# Altium schematic sheet Analog.SchDoc
size A4
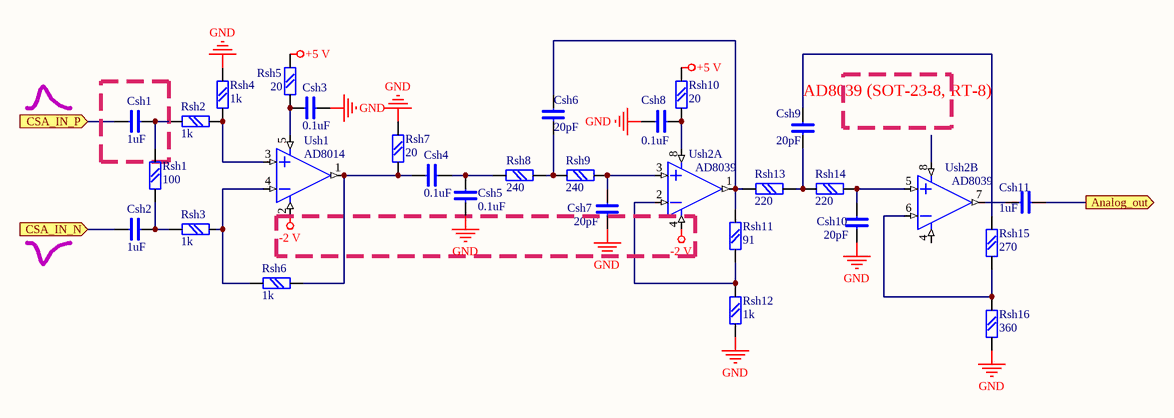
[diagram p0: Analog.SchDoc]

## Parts
Csh1  1uF  [chip0603]
Csh2  1uF  [chip0603]
Csh3  0.1uF  [chip0603]
Csh4  0.1uF  [chip0603]
Csh5  0.1uF  [chip0603]
Csh6  20pF  [chip0603]
Csh7  20pF  [chip0603]
Csh8  0.1uF  [chip0603]
Csh9  20pF  [chip0603]
Csh10  20pF  [chip0603]
Csh11  1uF  [chip0603]
Rsh1  100  [chip0603]
Rsh2  1k  [chip0603]
Rsh3  1k  [chip0603]
Rsh4  1k  [chip0603]
Rsh5  20  [chip0603]
Rsh6  1k  [chip0603]
Rsh7  20  [chip0603]
Rsh8  240  [chip0603]
Rsh9  240  [chip0603]
Rsh10  20  [chip0603]
Rsh11  91  [chip0603]
Rsh12  1k  [chip0603]
Rsh13  220  [chip0603]
Rsh14  220  [chip0603]
Rsh15  270  [chip0603]
Rsh16  360  [chip0603]
Ush1  AD8014  [RT-5]
Ush2  AD8039  [SOT23-8]  (parts A,B of 2)

## Ports
Analog_out (out), CSA_IN_N (in), CSA_IN_P (in)

## Nets
+5 V: Rsh5.2 Rsh10.2
-2 V: Ush1.2(E-) Ush2.4(E-)
GND: Csh3.2 Csh5.2 Csh7.2 Csh8.2 Csh10.2 Rsh4.2 Rsh7.1 Rsh12.1 Rsh16.1
Analog_out: Csh11.2 ; port Analog_out
CSA_IN_N: Csh2.1 ; port CSA_IN_N
CSA_IN_P: Csh1.1 ; port CSA_IN_P
NetCsh1_2: Csh1.2 Rsh1.2 Rsh2.1
NetCsh2_2: Csh2.2 Rsh1.1 Rsh3.1
NetCsh3_1: Csh3.1 Rsh5.1 Ush1.5(E+)
NetCsh4_1: Csh4.1 Csh5.1 Rsh8.2
NetCsh4_2: Csh4.2 Rsh6.2 Rsh7.2 Ush1.1(OUT)
NetCsh6_1: Csh6.1 Rsh11.2 Rsh13.2 Ush2.1(OUT)
NetCsh6_2: Csh6.2 Rsh8.1 Rsh9.1
NetCsh7_1: Csh7.1 Rsh9.2 Ush2.3(+IN)
NetCsh8_1: Csh8.1 Rsh10.1 Ush2.8(E+)
NetCsh9_1: Csh9.1 Rsh15.2
NetCsh9_2: Csh9.2 Rsh13.1 Rsh14.1
NetCsh10_1: Csh10.1 Rsh14.2 Ush2.5(+IN)
NetCsh11_1: Csh11.1 Ush2.7(OUT)
NetRsh2_2: Rsh2.2 Rsh4.1 Ush1.3(+IN)
NetRsh3_2: Rsh3.2 Rsh6.1 Ush1.4(-IN)
NetRsh11_1: Rsh11.1 Rsh12.2 Ush2.2(-IN)
NetRsh15_1: Rsh15.1 Rsh16.2 Ush2.6(-IN)

## Notes on the sheet
- (near Csh9) AD8039 (SOT-23-8, RT-8)

## Library data of the parts
Csh1-Csh11 = C: Text Field1: 20; Text Field2: 10
Rsh1-Rsh4 Rsh6 Rsh8 Rsh9 Rsh11-Rsh16 = R: Text Field1: 20; Text Field2: 20
Rsh5 Rsh7 Rsh10 = R: Text Field1: 20; Text Field2: 20
Ush1 = AD8005ART: Text Field1: 40; Text Field2: 40
Ush2 = AD8008